# Altium project BLE_TORQUE.PrjPCB
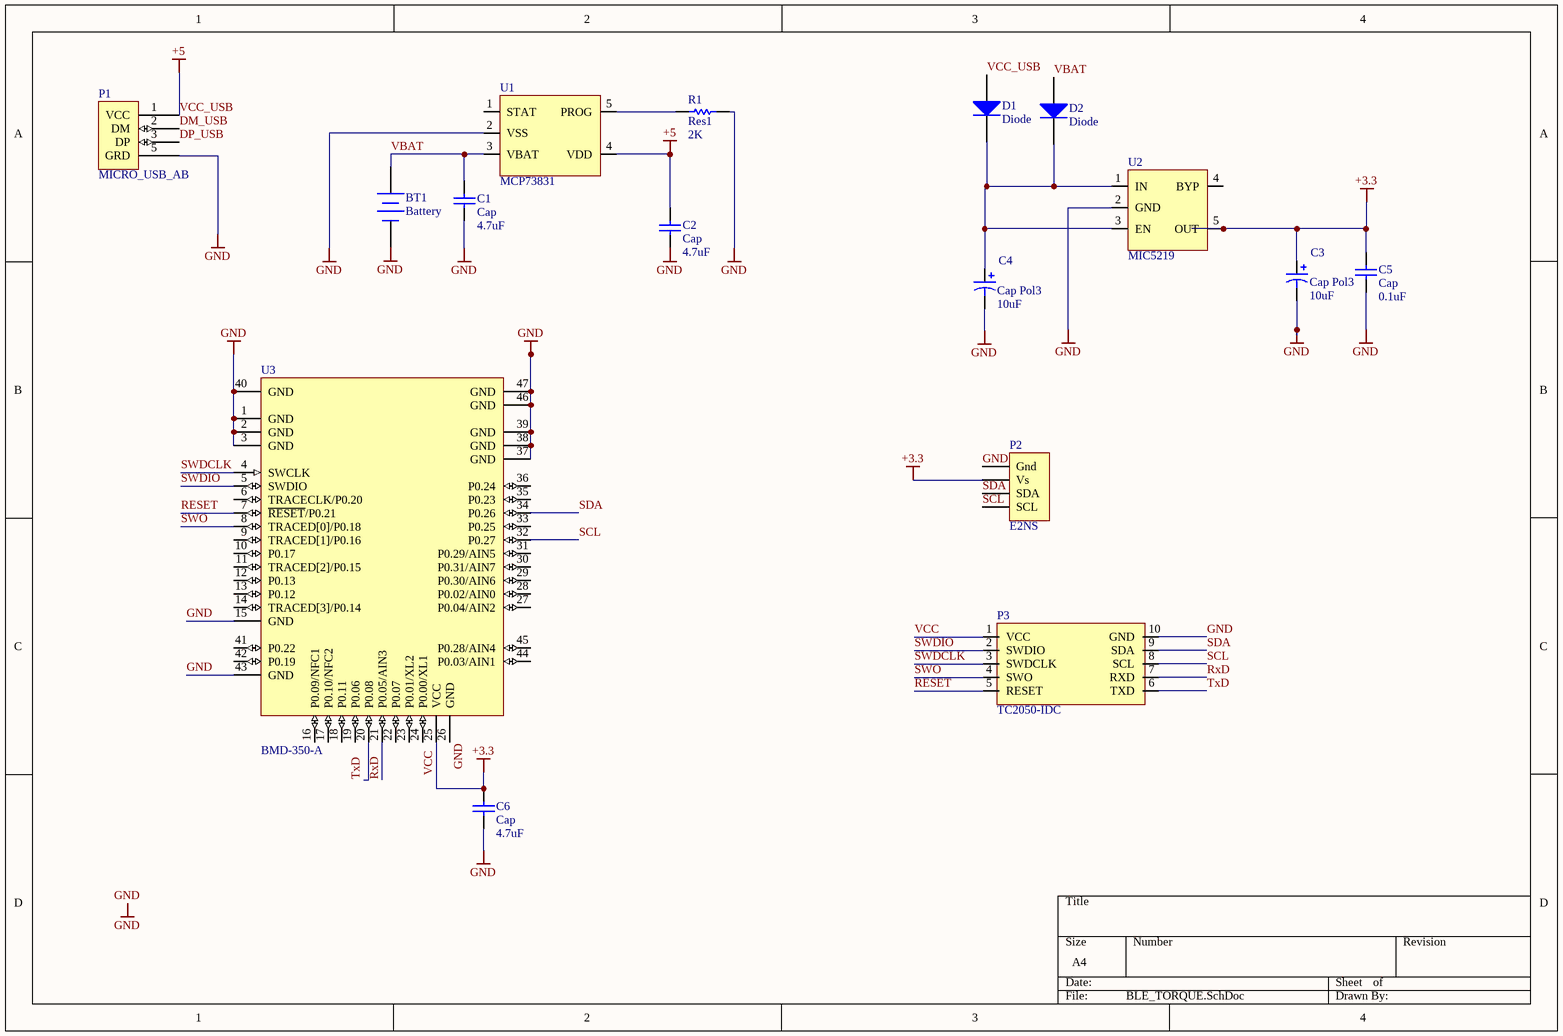
[diagram p0: BLE_TORQUE.SchDoc]
1 sheet, 16 parts. Net scope: global (net labels, ports and power ports of the same name join across sheets).
Board file: BLE_TORQUE.PcbDoc

## Sheet BLE_TORQUE.SchDoc
size A4

### Parts
BT1  Battery  [BAT-2]
C1  Cap  value 4.7uF  [C0805]
C2  Cap  value 4.7uF  [C0805]
C3  Cap Pol3  value 10uF  [C0805]
C4  Cap Pol3  value 10uF  [C0805]
C5  Cap  value 0.1uF  [C0805]
C6  Cap  value 4.7uF  [C0805]
D1  Diode  [SMB]
D2  Diode  [SMB]
P1  MICRO_USB_AB  [MICRO_USB_AB]
P2  E2NS  [HDR1X4]
P3  TC2050-IDC  [TC2050-IDC]
R1  Res1  value 2K  [C0805]
U1  MCP73831  [SOT-23-5]
U2  MIC5219  [SOT-23-5]
U3  BMD-350-A  [BMD-350]

### Nets
GND: BT1.2(-) C1.2 C2.2 C3.2 C4.2 C5.2 C6.2 P1.5(GRD) P2.1(Gnd) P3.10(GND) R1.2 U1.2(VSS) U2.2(GND) U3.1(GND) U3.2(GND) U3.3(GND) U3.15(GND) U3.26(GND) U3.37(GND) U3.38(GND) U3.39(GND) U3.40(GND) U3.43(GND) U3.46(GND) U3.47(GND)
VCC: C3.1 C5.1 C6.1 P2.2(Vs) P3.1(VCC) U2.5(OUT) U3.25(VCC)  [also labelled +3.3]
VCC_USB: C2.1 D1.1(A) P1.1(VCC) U1.4(VDD)  [also labelled +5]
DM_USB: P1.2(DM)
DP_USB: P1.3(DP)
RESET: P3.5(RESET) U3.7(~{RESET}/P0.21)
RxD: P3.7(RXD) U3.21(P0.05/AIN3)
SCL: P2.4(SCL) P3.8(SCL) U3.32(P0.27)
SDA: P2.3(SDA) P3.9(SDA) U3.34(P0.26)
SWDCLK: P3.3(SWDCLK) U3.4(SWCLK)
SWDIO: P3.2(SWDIO) U3.5(SWDIO)
SWO: P3.4(SWO) U3.8(TRACED[0]/P0.18)
TxD: P3.6(TXD) U3.20(P0.08)
VBAT: BT1.1(+) C1.1 D2.1(A) U1.3(VBAT)
NetC4_1: C4.1 D1.2(K) D2.2(K) U2.1(IN) U2.3(EN)
NetR1_1: R1.1 U1.5(PROG)

Not connected (* = marked no-connect by the designer): U1 1(STAT); U2 4(BYP); U3 6(TRACECLK/P0.20) 9(TRACED[1]/P0.16) 10(P0.17) 11(TRACED[2]/P0.15) 12(P0.13) 13(P0.12) 14(TRACED[3]/P0.14) 16(P0.09/NFC1) 17(P0.10/NFC2) 18(P0.11) 19(P0.06) 22(P0.07) 23(P0.01/XL2) 24(P0.00/XL1) 27(P0.04/AIN2) 28(P0.02/AIN0) 29(P0.30/AIN6) 30(P0.31/AIN7) 31(P0.29/AIN5) 33(P0.25) 35(P0.23) 36(P0.24) 41(P0.22) 42(P0.19) 44(P0.03/AIN1) 45(P0.28/AIN4)

### Library data of the parts
BT1 = Battery: Multicell Battery; Published: 24-Mar-1999; LatestRevisionDate: 17-Jul-2002; LatestRevisionNote: Re-released for DXP Platform.; PackageReference: BAT-2; Publisher: Altium Limited; PackageDescription: Battery; 2 Leads
C1 C2 C5 C6 = Cap: Capacitor; Published: 8-Jun-2000; LatestRevisionDate: 17-Jul-2002; LatestRevisionNote: Re-released for DXP Platform.; PackageReference: RAD-0.3; Publisher: Altium Limited; PackageDescription: Radial Cap, Thru-Hole; 2 Leads; 0.3 in Pin Spacing
C3 C4 = Cap Pol3: Polarized Capacitor (Surface Mount); Published: 8-Jun-2000; LatestRevisionDate: 29-May-2009; LatestRevisionNote: IPC-7351 Footprint Added.; PackageReference: C0805; Publisher: Altium Limited; PackageDescription: Chip Capacitor
D1 D2 = Diode: Default Diode; Published: 8-Jun-2000; LatestRevisionDate: 17-Jul-2002; LatestRevisionNote: Re-released for DXP Platform.; PackageVersion: Sep-1996; PackageReference: SMC; Publisher: Altium Limited; PackageDescription: DO-214-AB/SMC; 2 C-Bend Leads; Body 7.9 x 5.9 mm, inc. leads (LxW); Code_JEDEC: DO-214-AB
P2 = Header 4: Header, 4-Pin; LatestRevisionDate: 17-Jul-2002; LatestRevisionNote: Re-released for DXP Platform.; Publisher: Altium Limited
R1 = Res1: Resistor; Published: 8-Jun-2000; LatestRevisionDate: 17-Jul-2002; LatestRevisionNote: Re-released for DXP Platform.; PackageReference: AXIAL-0.3; Publisher: Altium Limited; PackageDescription: Axial Device, Thru-Hole; 2 Leads; 0.3 in Pin Spacing
U3 = BMD-350: Bluetooth 4.2 LE Module, nRF52832, 512kB Flash, 64kB RAM; Manufacturer: Rigado; Manufacturer P/N: BMD-350-A-R; Added By: Cam N; Internal Antenna: Ceramic Chip; Protocol: BLE 4.2; RF Freq: 2.4GHz; Added Date: 8/9/2016; Height: 1.5mm; Size: 8.65mm x 6.4mm; Part Number: BMD-350-A